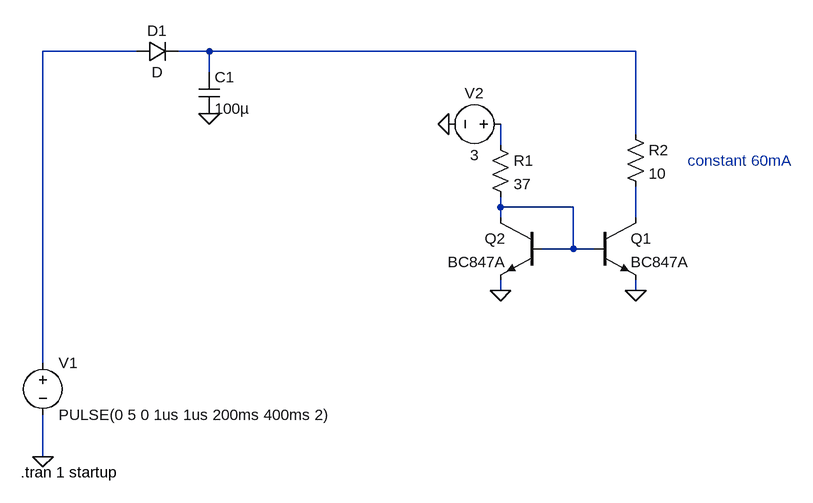
[diagram p0: schematic pwrfault.asc]
pwrfault.asc, the LTspice schematic file:
Version 4
SHEET 1 1220 680
WIRE 176 -384 32 -384
WIRE 288 -384 240 -384
WIRE 944 -384 288 -384
WIRE 288 -352 288 -384
WIRE 944 -256 944 -384
WIRE 736 -240 736 -272
WIRE 736 -144 736 -160
WIRE 848 -144 736 -144
WIRE 736 -128 736 -144
WIRE 944 -128 944 -176
WIRE 848 -80 848 -144
WIRE 848 -80 800 -80
WIRE 880 -80 848 -80
WIRE 736 -16 736 -32
WIRE 944 -16 944 -32
WIRE 32 96 32 -384
WIRE 32 240 32 176
FLAG 32 240 0
FLAG 736 -16 0
FLAG 944 -16 0
FLAG 656 -272 0
FLAG 288 -288 0
SYMBOL voltage 32 80 R0
WINDOW 39 0 0 Left 2
SYMATTR InstName V1
SYMATTR Value PULSE(0 5 0 1us 1us 200ms 400ms 2)
SYMATTR Value2 AC 0
SYMBOL diode 176 -368 R270
WINDOW 0 32 32 VTop 2
WINDOW 3 0 32 VBottom 2
SYMATTR InstName D1
SYMBOL cap 272 -352 R0
SYMATTR InstName C1
SYMATTR Value 100µ
SYMBOL npn 880 -128 R0
SYMATTR InstName Q1
SYMATTR Value BC847A
SYMBOL npn 800 -128 M0
SYMATTR InstName Q2
SYMATTR Value BC847A
SYMBOL voltage 752 -272 R90
WINDOW 0 -32 56 VBottom 2
WINDOW 3 32 56 VTop 2
WINDOW 123 0 0 Left 2
WINDOW 39 0 0 Left 2
SYMATTR InstName V2
SYMATTR Value 3
SYMBOL res 720 -256 R0
SYMATTR InstName R1
SYMATTR Value 37
SYMBOL res 928 -272 R0
SYMATTR InstName R2
SYMATTR Value 10
TEXT -2 264 Left 2 !.tran 1 startup
TEXT 1024 -216 Left 2 ;constant 60mA

The netlist it stands for:
* pwrfault.asc
V1 N001 0 PULSE(0 5 0 1us 1us 200ms 400ms 2) AC 0
D1 N001 N002 D
C1 N002 0 100µ
Q1 N005 N004 0 0 BC847A
Q2 N004 N004 0 0 BC847A
V2 N003 0 3
R1 N003 N004 37
R2 N002 N005 10
.model D D
.lib standard.dio
.model NPN NPN
.model PNP PNP
.lib standard.bjt
.tran 1 startup
* constant 60mA
.backanno
.end